# Altium schematic sheet LPCB225 - STACK CONNECTORS.SchDoc
size A3; Address1: Factory 10; Address2: 9-13 Dingley Avenue, Dandeong, VICTORIA 3175, AUSTRALIA; DocumentNumber: 6; Revision: 1; SheetNumber: 6; SheetTotal: 6; Lockie__PCB_SUB_ASSEMBLY: Stackup Connectors; Lockie__PCB_ASSEMBLY: Module; Lockie__LDL: LPCB225; Lockie__PCB_DESCRIPTION: BMS Module
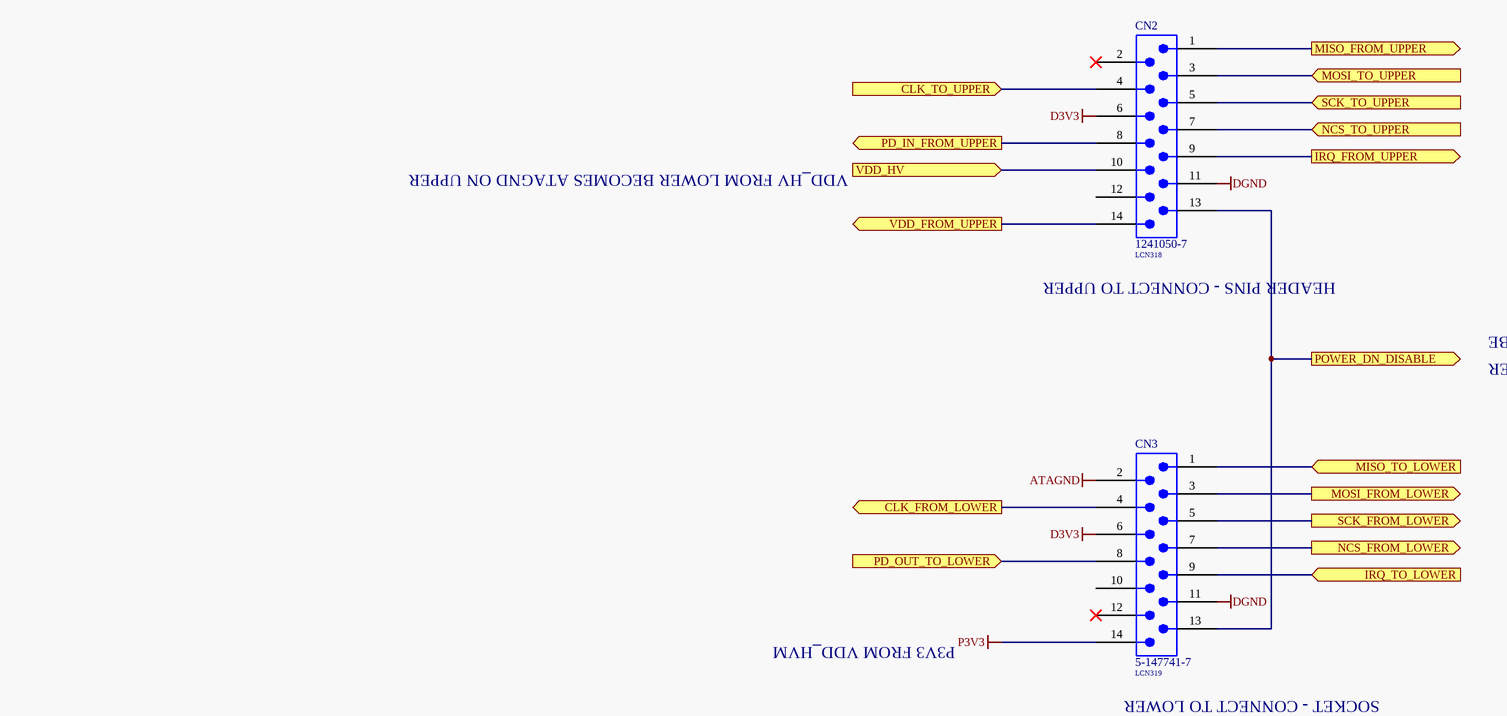
[diagram p0: LPCB225 - STACK CONNECTORS.SchDoc]

## Parts
CN2  1241050-7  LDL_NUMBER: LCN318  [1241050-7]
CN3  5-147741-7  LDL_NUMBER: LCN319  [5-147741-7]

## Ports
CLK_FROM_LOWER (out), CLK_TO_UPPER (in), IRQ_FROM_UPPER (out), IRQ_TO_LOWER (in), MISO_FROM_UPPER (out), MISO_TO_LOWER (in), MOSI_FROM_LOWER (out), MOSI_TO_UPPER (in), NCS_FROM_LOWER (out), NCS_TO_UPPER (in), PD_IN_FROM_UPPER (out), PD_OUT_TO_LOWER (in), POWER_DN_DISABLE (out), SCK_FROM_LOWER (out), SCK_TO_UPPER (in), VDD_FROM_UPPER (out), VDD_HV (in)

## Nets
ATAGND: CN3.2
D3V3: CN2.6 CN3.6
DGND: CN2.11 CN3.11
P3V3: CN3.14
CLK_FROM_LOWER: CN3.4 ; port CLK_FROM_LOWER
CLK_TO_UPPER: CN2.4 ; port CLK_TO_UPPER
IRQ_FROM_UPPER: CN2.9 ; port IRQ_FROM_UPPER
IRQ_TO_LOWER: CN3.9 ; port IRQ_TO_LOWER
MISO_FROM_UPPER: CN2.1 ; port MISO_FROM_UPPER
MISO_TO_LOWER: CN3.1 ; port MISO_TO_LOWER
MOSI_FROM_LOWER: CN3.3 ; port MOSI_FROM_LOWER
MOSI_TO_UPPER: CN2.3 ; port MOSI_TO_UPPER
NCS_FROM_LOWER: CN3.7 ; port NCS_FROM_LOWER
NCS_TO_UPPER: CN2.7 ; port NCS_TO_UPPER
PD_IN_FROM_UPPER: CN2.8 ; port PD_IN_FROM_UPPER
PD_OUT_TO_LOWER: CN3.8 ; port PD_OUT_TO_LOWER
POWER_DN_DISABLE: CN2.13 CN3.13 ; port POWER_DN_DISABLE
SCK_FROM_LOWER: CN3.5 ; port SCK_FROM_LOWER
SCK_TO_UPPER: CN2.5 ; port SCK_TO_UPPER
VDD_FROM_UPPER: CN2.14 ; port VDD_FROM_UPPER
VDD_HV: CN2.10 ; port VDD_HV

Not connected (* = marked no-connect by the designer): CN2 2* 12; CN3 10 12*

## Notes on the sheet
- VDD_HV FROM LOWER BECOMES ATAGND ON UPPER
- HEADER PINS - CONNECT TO UPPER
- ALLOWS PWR_DN ON TOP BOARD TO BE
- CONTROLLER BY BASE MASTER
- P3V3 FROM VDD_HVM
- SOCKET - CONNECT TO LOWER
- PCB COMPONENT DESCRIPTION
- LDL NUMBER
- Assembly Details
- Size
- Drawing File Name
- Revision
- http://rloop.org
- Scale
- A3
- Sheet Details
- N.T.S
- Sheet:
- Of:

## Library data of the parts
CN2 = 1241050-7: Connector, Header, 2.54mm, 7 Pins x 2 Rows, SMD; FMEDA__CHANNEL: COM; FMEDA__OPERATING__CURRENT_MAX: 0; FMEDA__OPERATING__TEMP_MAX: 50; FMEDA__OPERATING__TEMP_MIN: -20; FMEDA__OPERATING__TEMP_TYP: 27; FMEDA__OPERATING__VOLTAGE_MAX: 16; FMEDA__OPERATING__VOLTAGE_TYP: 12; FMEDA__FUNCTION_IN_SYSTEM: *; FMEDA__OPERATING__CURRENT_MIN: 0; FMEDA__OPERATING__CURRENT_TYP: 0; FMEDA__OPERATING__VOLTAGE_MIN: 0
CN3 = 5-147741-7: Connector, Socket, 2.54mm, 7 pins x 2 Rows, SMD; FMEDA__CHANNEL: COM; FMEDA__OPERATING__CURRENT_MAX: 0; FMEDA__OPERATING__TEMP_MAX: 50; FMEDA__OPERATING__TEMP_MIN: -20; FMEDA__OPERATING__TEMP_TYP: 27; FMEDA__OPERATING__VOLTAGE_MAX: 16; FMEDA__OPERATING__VOLTAGE_TYP: 12; FMEDA__FUNCTION_IN_SYSTEM: *; FMEDA__OPERATING__CURRENT_MIN: 0; FMEDA__OPERATING__CURRENT_TYP: 0; FMEDA__OPERATING__VOLTAGE_MIN: 0